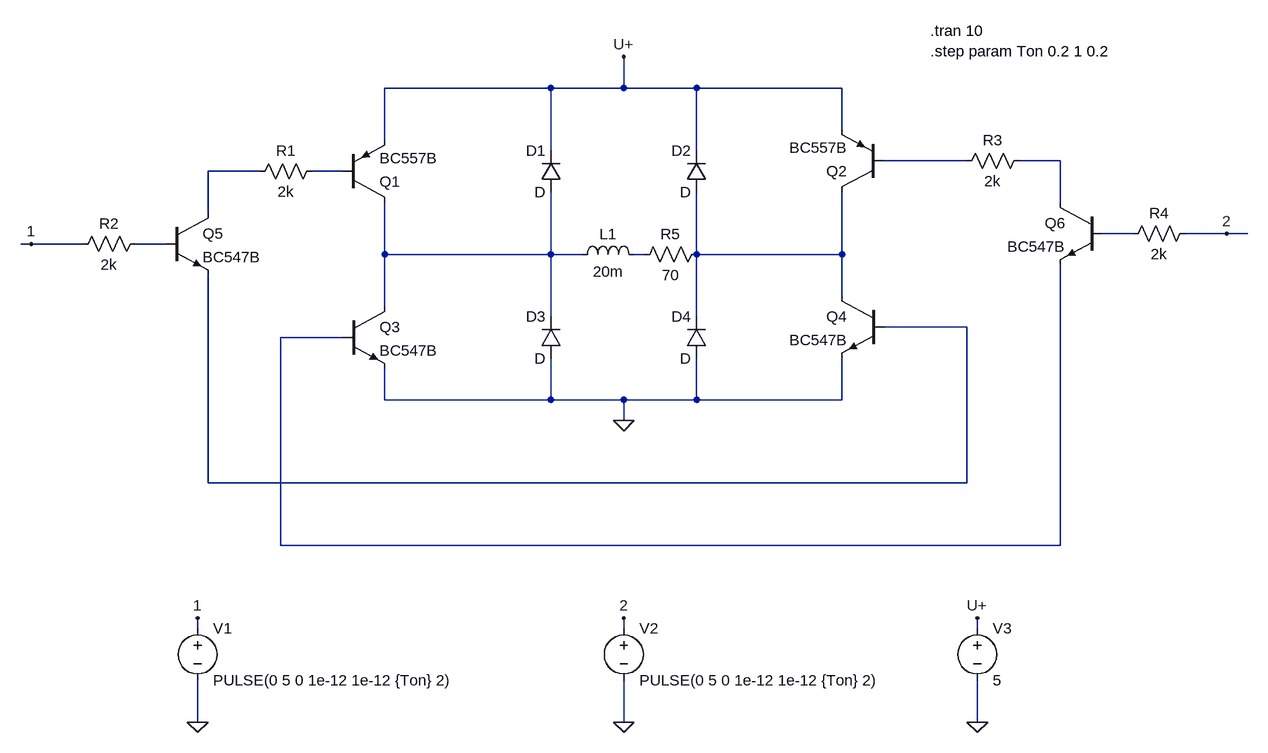
[diagram p0: schematic последнее.asc]
последнее.asc, the LTspice schematic file:
Version 4
SHEET 1 2956 1324
WIRE 1472 160 1216 160
WIRE 1584 160 1584 112
WIRE 1584 160 1472 160
WIRE 1696 160 1584 160
WIRE 1920 160 1696 160
WIRE 1920 224 1920 160
WIRE 1216 240 1216 160
WIRE 1472 256 1472 160
WIRE 1696 256 1696 160
WIRE 2112 272 1984 272
WIRE 2256 272 2192 272
WIRE 1024 288 944 288
WIRE 1152 288 1104 288
WIRE 2256 336 2256 272
WIRE 944 352 944 288
WIRE 2368 384 2320 384
WIRE 2512 384 2448 384
WIRE 2544 384 2512 384
WIRE 672 400 656 400
WIRE 752 400 672 400
WIRE 880 400 832 400
WIRE 1216 416 1216 336
WIRE 1472 416 1472 320
WIRE 1472 416 1216 416
WIRE 1520 416 1472 416
WIRE 1616 416 1600 416
WIRE 1696 416 1696 320
WIRE 1920 416 1920 320
WIRE 1920 416 1696 416
WIRE 1920 480 1920 416
WIRE 1216 496 1216 416
WIRE 1472 512 1472 416
WIRE 1696 512 1696 416
WIRE 2112 528 1984 528
WIRE 1152 544 1056 544
WIRE 1216 640 1216 592
WIRE 1472 640 1472 576
WIRE 1472 640 1216 640
WIRE 1584 640 1472 640
WIRE 1696 640 1696 576
WIRE 1696 640 1584 640
WIRE 1920 640 1920 576
WIRE 1920 640 1696 640
WIRE 1584 672 1584 640
WIRE 944 768 944 448
WIRE 2112 768 2112 528
WIRE 2112 768 944 768
WIRE 1056 864 1056 544
WIRE 2256 864 2256 432
WIRE 2256 864 1056 864
WIRE 928 992 928 976
WIRE 1584 992 1584 976
WIRE 2128 992 2128 976
WIRE 928 1136 928 1072
WIRE 1584 1136 1584 1072
WIRE 2128 1136 2128 1072
FLAG 928 976 1
FLAG 928 1136 0
FLAG 1584 976 2
FLAG 1584 1136 0
FLAG 2128 976 U+
FLAG 2128 1136 0
FLAG 1584 112 U+
FLAG 672 400 1
FLAG 2512 384 2
FLAG 1584 672 0
SYMBOL voltage 928 976 R0
WINDOW 123 0 0 Left 0
WINDOW 39 0 0 Left 0
SYMATTR InstName V1
SYMATTR Value PULSE(0 5 0 1e-12 1e-12 {Ton} 2)
SYMBOL voltage 1584 976 R0
WINDOW 123 0 0 Left 0
WINDOW 39 0 0 Left 0
SYMATTR InstName V2
SYMATTR Value PULSE(0 5 0 1e-12 1e-12 {Ton} 2)
SYMBOL pnp 1152 336 M180
SYMATTR InstName Q1
SYMATTR Value BC557B
SYMBOL pnp 1984 320 R180
SYMATTR InstName Q2
SYMATTR Value BC557B
SYMBOL npn 1152 496 R0
SYMATTR InstName Q3
SYMATTR Value BC547B
SYMBOL npn 1984 480 M0
SYMATTR InstName Q4
SYMATTR Value BC547B
SYMBOL diode 1488 320 R180
WINDOW 0 24 64 Left 2
WINDOW 3 24 0 Left 2
SYMATTR InstName D1
SYMBOL res 848 384 R90
WINDOW 0 0 56 VBottom 2
WINDOW 3 32 56 VTop 2
SYMATTR InstName R2
SYMATTR Value 2k
SYMBOL res 2208 256 R90
WINDOW 0 0 56 VBottom 2
WINDOW 3 32 56 VTop 2
SYMATTR InstName R3
SYMATTR Value 2k
SYMBOL voltage 2128 976 R0
WINDOW 123 0 0 Left 0
WINDOW 39 0 0 Left 0
SYMATTR InstName V3
SYMATTR Value 5
SYMBOL diode 1712 320 R180
WINDOW 0 24 64 Left 2
WINDOW 3 24 0 Left 2
SYMATTR InstName D2
SYMBOL diode 1488 576 R180
WINDOW 0 24 64 Left 2
WINDOW 3 24 0 Left 2
SYMATTR InstName D3
SYMBOL diode 1712 576 R180
WINDOW 0 24 64 Left 2
WINDOW 3 24 0 Left 2
SYMATTR InstName D4
SYMBOL res 1712 400 R90
WINDOW 0 0 56 VBottom 2
WINDOW 3 32 56 VTop 2
SYMATTR InstName R5
SYMATTR Value 70
SYMBOL npn 880 352 R0
SYMATTR InstName Q5
SYMATTR Value BC547B
SYMBOL res 1120 272 R90
WINDOW 0 0 56 VBottom 2
WINDOW 3 32 56 VTop 2
SYMATTR InstName R1
SYMATTR Value 2k
SYMBOL npn 2320 336 M0
SYMATTR InstName Q6
SYMATTR Value BC547B
SYMBOL res 2464 368 R90
WINDOW 0 0 56 VBottom 2
WINDOW 3 32 56 VTop 2
SYMATTR InstName R4
SYMATTR Value 2k
SYMBOL ind 1504 432 R270
WINDOW 0 32 56 VTop 2
WINDOW 3 5 56 VBottom 2
SYMATTR InstName L1
SYMATTR Value 20m
TEXT 2056 72 Left 2 !.tran 10\n.step param Ton 0.2 1 0.2

The netlist it stands for:
* последнее.asc
V1 1 0 PULSE(0 5 0 1e-12 1e-12 {Ton} 2)
V2 2 0 PULSE(0 5 0 1e-12 1e-12 {Ton} 2)
Q1 N007 N004 U+ 0 BC557B
Q2 N009 N001 U+ 0 BC557B
Q3 N007 N011 0 0 BC547B
Q4 N009 N010 0 0 BC547B
D1 N007 U+ D
R2 N006 1 2k
R3 N002 N001 2k
V3 U+ 0 5
D2 N009 U+ D
D3 0 N007 D
D4 0 N009 D
R5 N009 N008 70
Q5 N003 N006 N010 0 BC547B
R1 N004 N003 2k
Q6 N002 N005 N011 0 BC547B
R4 2 N005 2k
L1 N007 N008 20m
.model D D
.lib standard.dio
.model NPN NPN
.model PNP PNP
.lib standard.bjt
.tran 10
.step param Ton 0.2 1 0.2
.backanno
.end

* Results of the author's LTspice run, read from the files saved beside the schematic
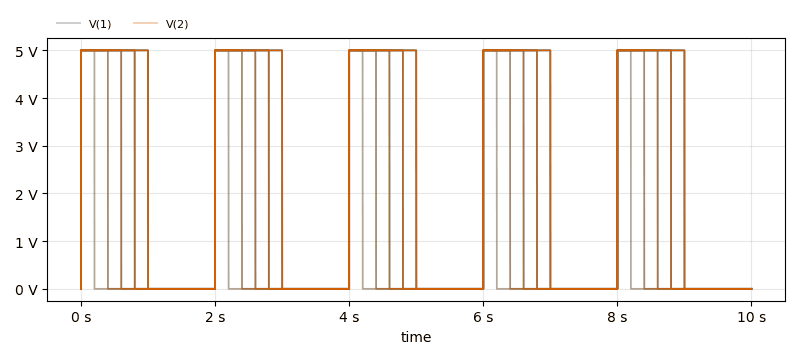
[diagram p1: Transient Analysis of последнее.asc, plotted from the saved traces]
* Transient Analysis, 5 runs:
*   V(1) [ton=0.2]: min 0 V, max 5 V, average 500 mV, rms 1.581 V, last 0 V
*   V(1) [ton=0.4]: min 0 V, max 5 V, average 1 V, rms 2.236 V, last 0 V
*   V(1) [ton=0.6]: min 0 V, max 5 V, average 1.5 V, rms 2.739 V, last 0 V
*   V(1) [ton=0.8]: min 0 V, max 5 V, average 2 V, rms 3.162 V, last 0 V
*   V(1) [ton=1]: min 0 V, max 5 V, average 2.5 V, rms 3.536 V, last 0 V
*   V(2) [ton=0.2]: min 0 V, max 5 V, average 500 mV, rms 1.581 V, last 0 V
*   V(2) [ton=0.4]: min 0 V, max 5 V, average 1 V, rms 2.236 V, last 0 V
*   V(2) [ton=0.6]: min 0 V, max 5 V, average 1.5 V, rms 2.739 V, last 0 V
*   V(2) [ton=0.8]: min 0 V, max 5 V, average 2 V, rms 3.162 V, last 0 V
*   V(2) [ton=1]: min 0 V, max 5 V, average 2.5 V, rms 3.536 V, last 0 V